# Altium schematic sheet CBLine.SchDoc
size A
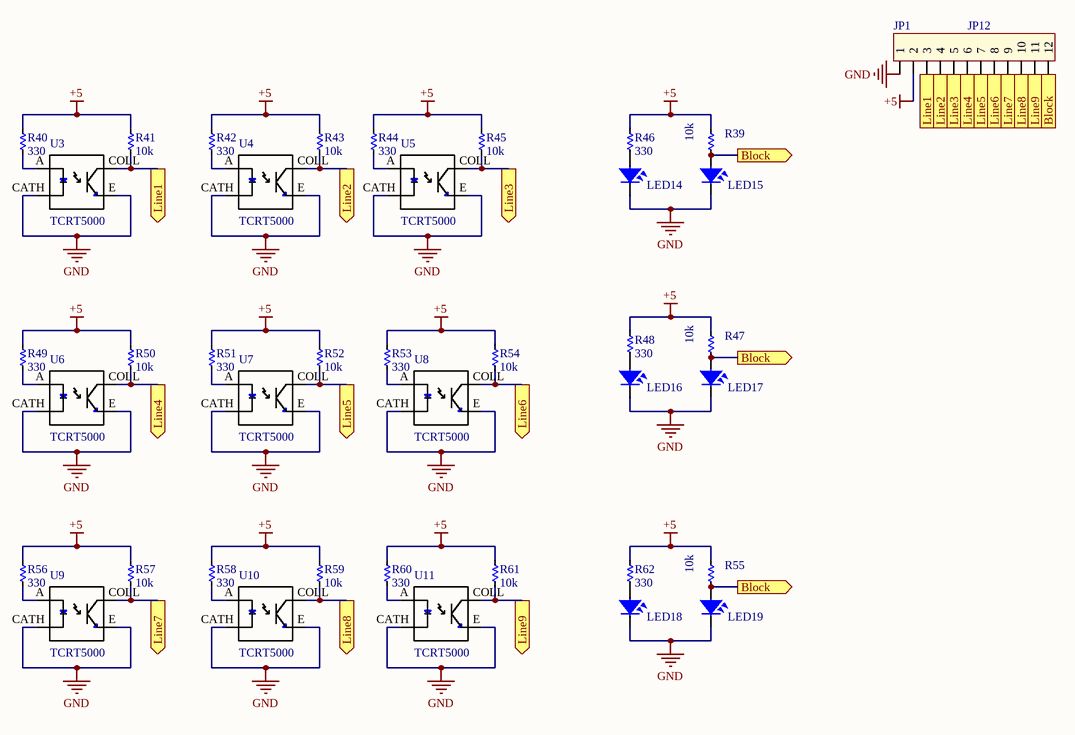
[diagram p0: CBLine.SchDoc]

## Parts
JP1  JP12  [Header12]
LED14  LED  [LED-3MM-YELLOW]  (value not drawn)
LED15  LED  [LED-3MM-YELLOW]  (value not drawn)
LED16  LED  [LED-3MM-YELLOW]  (value not drawn)
LED17  LED  [LED-3MM-YELLOW]  (value not drawn)
LED18  LED  [LED-3MM-YELLOW]  (value not drawn)
LED19  LED  [LED-3MM-YELLOW]  (value not drawn)
R39  10k  [RES-SMD-0805]
R40  330  [RES-SMD-0805]
R41  10k  [RES-SMD-0805]
R42  330  [RES-SMD-0805]
R43  10k  [RES-SMD-0805]
R44  330  [RES-SMD-0805]
R45  10k  [RES-SMD-0805]
R46  330  [RES-SMD-0805]
R47  10k  [RES-SMD-0805]
R48  330  [RES-SMD-0805]
R49  330  [RES-SMD-0805]
R50  10k  [RES-SMD-0805]
R51  330  [RES-SMD-0805]
R52  10k  [RES-SMD-0805]
R53  330  [RES-SMD-0805]
R54  10k  [RES-SMD-0805]
R55  10k  [RES-SMD-0805]
R56  330  [RES-SMD-0805]
R57  10k  [RES-SMD-0805]
R58  330  [RES-SMD-0805]
R59  10k  [RES-SMD-0805]
R60  330  [RES-SMD-0805]
R61  10k  [RES-SMD-0805]
R62  330  [RES-SMD-0805]
U3  TCRT5000  [*OPTO_TCRT5000_TCRT5000(Primary)]
U4  TCRT5000  [*OPTO_TCRT5000_TCRT5000(Primary)]
U5  TCRT5000  [*OPTO_TCRT5000_TCRT5000(Primary)]
U6  TCRT5000  [*OPTO_TCRT5000_TCRT5000(Primary)]
U7  TCRT5000  [*OPTO_TCRT5000_TCRT5000(Primary)]
U8  TCRT5000  [*OPTO_TCRT5000_TCRT5000(Primary)]
U9  TCRT5000  [*OPTO_TCRT5000_TCRT5000(Primary)]
U10  TCRT5000  [*OPTO_TCRT5000_TCRT5000(Primary)]
U11  TCRT5000  [*OPTO_TCRT5000_TCRT5000(Primary)]

## Ports
Block (out), Line1 (out), Line2 (out), Line3 (out), Line4 (out), Line5 (out), Line6 (out), Line7 (out), Line8 (out), Line9 (out)

## Nets
+5: JP1.2 R39.1 R40.1 R41.1 R42.1 R43.1 R44.1 R45.1 R46.1 R47.1 R48.1 R49.1 R50.1 R51.1 R52.1 R53.1 R54.1 R55.1 R56.1 R57.1 R58.1 R59.1 R60.1 R61.1 R62.1
GND: JP1.1 LED14.2 LED15.2 LED16.2 LED17.2 LED18.2 LED19.2 U3.CATH U3.E U4.CATH U4.E U5.CATH U5.E U6.CATH U6.E U7.CATH U7.E U8.CATH U8.E U9.CATH U9.E U10.CATH U10.E U11.CATH U11.E
Block: JP1.12 LED15.1 LED17.1 LED19.1 R39.2 R47.2 R55.2 ; port Block
Line1: JP1.3 R41.2 U3.COLL ; port Line1
Line2: JP1.4 R43.2 U4.COLL ; port Line2
Line3: JP1.5 R45.2 U5.COLL ; port Line3
Line4: JP1.6 R50.2 U6.COLL ; port Line4
Line5: JP1.7 R52.2 U7.COLL ; port Line5
Line6: JP1.8 R54.2 U8.COLL ; port Line6
Line7: JP1.9 R57.2 U9.COLL ; port Line7
Line8: JP1.10 R59.2 U10.COLL ; port Line8
Line9: JP1.11 R61.2 U11.COLL ; port Line9
NetLED14_1: LED14.1 R46.2
NetLED16_1: LED16.1 R48.2
NetLED18_1: LED18.1 R62.2
NetR40_2: R40.2 U3.A
NetR42_2: R42.2 U4.A
NetR44_2: R44.2 U5.A
NetR49_2: R49.2 U6.A
NetR51_2: R51.2 U7.A
NetR53_2: R53.2 U8.A
NetR56_2: R56.2 U9.A
NetR58_2: R58.2 U10.A
NetR60_2: R60.2 U11.A

## Library data of the parts
JP1 = Header12: Connector 12; Value: Connector 12
LED14-LED19 = LED: LED Single colour Green and Red; Value: LED 3 ly Single Colour
R39-R62 = Res-SMD: Resistor; Manufacturer: Generic Components; Class: Passive; Published: 08/06/2000; Publisher: Altium Hobart Technology Centre
U3-U11 = TCRT5000: 950 nm 60 mA Through Hole Reflective Optical Sensor with Transistor Output; MF: Vishay; Package: PCB Mount Vishay; Availability: Unavailable; MP: TCRT5000; Price: None; SnapEDA_Link: https://www.snapeda.com/parts/TCRT5000/Vishay%20Semiconductor%20Opto%20Division/view-part/?ref=snap; Value: *